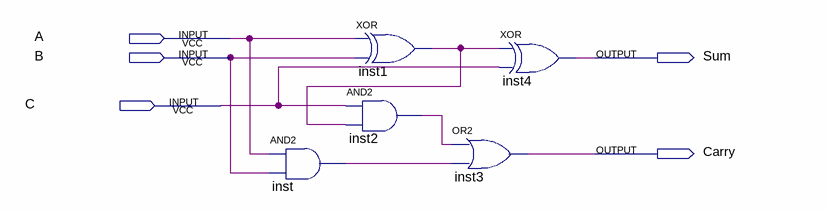
[diagram p0: schematic sheet]
// Quartus schematic fulladder_1b.bdf as structural Verilog: 5 symbols, 5 pins
module fulladder_1b (
  input  A,
  input  B,
  input  C,
  output Sum,
  output Carry
);

  wire inst1_out, inst2_out, inst_out;

  and inst (inst_out, A, B);
  xor inst1 (inst1_out, A, B);
  and inst2 (inst2_out, C, inst1_out);
  or inst3 (Carry, inst2_out, inst_out);
  xor inst4 (Sum, inst1_out, C);
endmodule
